# Altium schematic sheet PowerSupply.SchDoc: Power Supply
size A4; Date: 08.04.2017; Author: Jan Petrik; CompanyName: FreeDSP; DrawnBy: Jan Petrik; Organization: FreeDSP; DocumentNumber: 2; SheetNumber: 2; SheetTotal: 16; email: jan_petrik@centrum.cz; license: CC BY-NC 4.0; PageSetup: Record=PageOptions|CenterHorizontal=True|CenterVertical=True|PrintScale=0.97|XCorrection=1.00|YCorrection=1.00|PrintKind=2|BorderSize=5000000|LeftOffset=0|BottomOffset=0|Orientation=2|PaperLength=1000|PaperWidth=1000|Scale=100|PaperSource=7|PrintQuality=-3|MediaType=1|DitherType=10|PrintScaleMode=1|PaperKind=A4|PaperIndex=9; drawing number: blablabla; Version1: N/A; Version2: N/A; Version3: N/A; Change1description: N/A; Change2description: N/A; Change3description: N/A; Change1DrawnBy: N/A; Change2DrawnBy: N/A; Change3DrawnBy: N/A; Change1CheckedBy: N/A; Change2CheckedBy: N/A; Change3CheckedBy: N/A; PreviusVersion_Chng1: N/A; PreviusVersion_Chng2: N/A; PreviusVersion_Chng3: N/A; Variant1description: Standard assembly; Variant2description: N/A; Variant3description: N/A; Variant4description: N/A
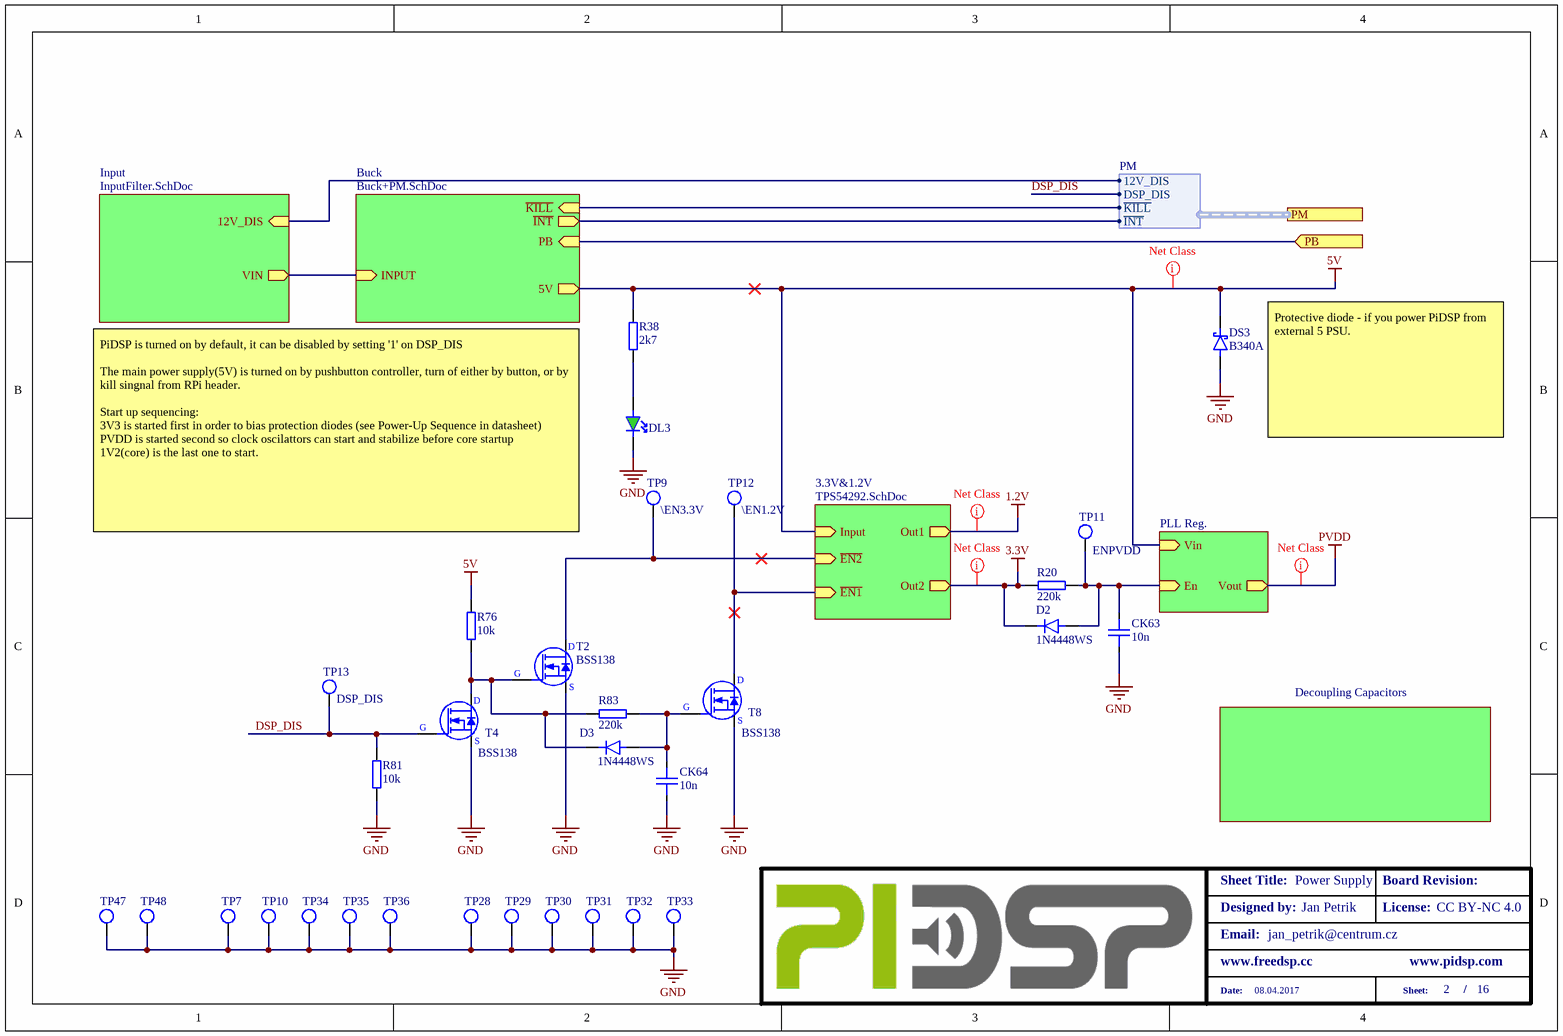
[diagram p0: PowerSupply.SchDoc]

## Parts
CK63  10n  [CAPC1608X09N(SMC0603)]
CK64  10n  [CAPC1608X09N(SMC0603)]
D2  1N4448WS  [SOD-323]
D3  1N4448WS  [SOD-323]
DL3  GREEN  [0603diode]  (value not drawn)
DS3  B340A  [DIOM5127X23N(SMA)]
R20  220k  [RESC1608X06N(SMR0603)]
R38  2k7  [RESC1608X06N(SMR0603)]
R76  10k  [RESC1608X06N(SMR0603)]
R81  10k  [RESC1608X06N(SMR0603)]
R83  220k  [RESC1608X06N(SMR0603)]
T2  BSS138  [SOT95P230X110-3N(SOT23)]
T4  BSS138  [SOT95P230X110-3N(SOT23)]
T8  BSS138  [SOT95P230X110-3N(SOT23)]
TP7  GND  [TP_0.8/0.4_ROUND]  (value not drawn)  (no BOM)
TP9  \EN3.3V  [TP_0.8/0.4_ROUND]  (no BOM)
TP10  GND  [TP_0.8/0.4_ROUND]  (value not drawn)  (no BOM)
TP11  ENPVDD  [TP_0.8/0.4_ROUND]  (no BOM)
TP12  \EN1.2V  [TP_0.8/0.4_ROUND]  (no BOM)
TP13  DSP_DIS  [TP_0.8/0.4_ROUND]  (no BOM)
TP28  GND  [TP_0.8/0.4_ROUND]  (value not drawn)  (no BOM)
TP29  GND  [TP_0.8/0.4_ROUND]  (value not drawn)  (no BOM)
TP30  GND  [TP_0.8/0.4_ROUND]  (value not drawn)  (no BOM)
TP31  GND  [TP_0.8/0.4_ROUND]  (value not drawn)  (no BOM)
TP32  GND  [TP_0.8/0.4_ROUND]  (value not drawn)  (no BOM)
TP33  GND  [TP_0.8/0.4_ROUND]  (value not drawn)  (no BOM)
TP34  GND  [TP_0.8/0.4_ROUND]  (value not drawn)  (no BOM)
TP35  GND  [TP_0.8/0.4_ROUND]  (value not drawn)  (no BOM)
TP36  GND  [TP_0.8/0.4_ROUND]  (value not drawn)  (no BOM)
TP47  GND  [TP_0.8/0.4_ROUND]  (value not drawn)  (no BOM)
TP48  GND  [TP_0.8/0.4_ROUND]  (value not drawn)  (no BOM)

## Sub-sheets
3.3V&1.2V = TPS54292.SchDoc: Out2 (out), Out1 (out), Input (in), ~{EN1} (in), ~{EN2} (in)
Buck = Buck+PM.SchDoc: PB (in), INPUT (in), 5V (out), ~{KILL} (in), ~{INT} (out)
Decoupling Capacitors = DSPPower.SchDoc: no entries
Input = InputFilter.SchDoc: VIN (out), 12V_DIS (in)
PLL Reg. = LP5907MFX-3.3NPB.SchDoc: Vin (in), Vout (out), En (in)

## Ports
PB (in), PM (harness PM)

## Harnesses
PM: ~{INT}, ~{KILL}, DSP_DIS, 12V_DIS

## Nets
1.2V: sheet 3.3V&1.2V/Out1
3.3V: D2.1(C) R20.2 ; sheet 3.3V&1.2V/Out2
5V: DS3.1(C) R38.1 R76.2 ; sheet PLL Reg./Vin, sheet 3.3V&1.2V/Input, sheet Buck/5V
GND: CK63.2 CK64.1 DL3.1(C) DS3.2(A) R81.1 T2.2(S) T4.2(S) T8.2(S) TP7.1 TP10.1 TP28.1 TP29.1 TP30.1 TP31.1 TP32.1 TP33.1 TP34.1 TP35.1 TP36.1 TP47.1 TP48.1
PVDD: sheet PLL Reg./Vout
DSP_DIS: R81.2 T4.1(G) TP13.1 ; port PM.DSP_DIS
PB: port PB, sheet Buck/PB
NetCK63_1: CK63.1 D2.2(A) R20.1 TP11.1 ; sheet PLL Reg./En
NetCK64_2: CK64.2 D3.2(A) R83.2 T8.1(G)
NetD3_1: D3.1(C) R76.1 R83.1 T2.1(G) T4.3(D)
NetDL3_2: DL3.2(A) R38.2
NetT2_3: T2.3(D) TP9.1 ; sheet 3.3V&1.2V/~{EN2}
NetT8_3: T8.3(D) TP12.1 ; sheet 3.3V&1.2V/~{EN1}
(unnamed): sheet Input/VIN, sheet Buck/INPUT
(unnamed): sheet Input/12V_DIS, port PM.12V_DIS
(unnamed): sheet Buck/~{KILL}, port PM.~{KILL}
(unnamed): sheet Buck/~{INT}, port PM.~{INT}

## Layout directives
net class POWER: 1.2V, 3.3V, 5V, PVDD

## Notes on the sheet
- (near DS3) Protective diode - if you power PiDSP from external 5 PSU.
- PiDSP is turned on by default, it can be disabled by setting '1' on DSP_DIS
  The main power supply(5V) is turned on by pushbutton controller, turn of either by button, or by kill singnal from RPi header.
  Start up sequencing:
  3V3 is started first in order to bias protection diodes (see Power-Up Sequence in datasheet)
  PVDD is started second so clock oscilattors can start and stabilize before core startup
  1V2(core) is the last one to start.
- Designed by:
- Sheet Title:
- Board Revision:
- License:
- Email:
- www.freedsp.cc
- www.pidsp.com
- Date:
- Sheet:
- /

## Library data of the parts
CK63 CK64 = 10n-50V-0603-X7R: MLCC; Signal Integrity: Cap; Voltage: 50V; Tolerance: 10%; Value: 10n; Package: SMC0603; Simulation: Cap; Author: JP/27.03.2014; Supplier 1: Mouser; Supplier Part Number 1: 81-GRM39X103K50D
D2 D3 = 1N4448WS: Small signal diode; Current: 0.150A; Voltage: 75V; SMD: 1; Type: Diode; Package: SOD-323; Supplier 1: Mouser; Supplier Part Number 1: 512-1N4448WS
DL3 = LED_GREEN_0603: Green LED, 0603; Author: JP/31.3.2014; SMD: 1; Supplier 1: Mouser; Supplier Part Number 1: 710-150060GS75000
DS3 = B340A: High Current Density SMT Schottky Rectifier, 3A/40V, SMA; SMD: 1; Supplier 1: Mouser; Supplier Part Number 1: 621-B340-F; Value: B340A
R20 R83 = 220k-100mW-0603-ThickFilm: Chip Resistor; Tolerance & Rating: 1%/0.1W; Signal Integrity: Res; Packare: SMR0603; Value: 220k; Simulation: Res; Author: JP/10.06.2014; SMD: 1; Supplier 1: Mouser; Supplier Part Number 1: 603-RC0603FR-07220KL; Type: Resistor
R38 = 2K7-100mW-0603-ThickFilm: Chip Resistor; Tolerance & Rating: 1%/0.1W; Signal Integrity: Res; Packare: SMR0603; Value: 2k7; Simulation: Res; Author: JP/26.03.2017; SMD: 1; Supplier 1: Mouser; Supplier Part Number 1: 603-RC0603FR-072K7L; Type: Resistor
R76 R81 = 10k-100mW-0603-ThickFilm: Chip Resistor; Tolerance & Rating: 1%/0.1W; Signal Integrity: Res; Packare: SMR0603; Value: 10k; Simulation: Res; Author: JP/10.06.2014; SMD: 1; Supplier 1: Mouser; Supplier Part Number 1: 603-RC0603FR-0710KL; Type: Resistor
T2 T4 T8 = ET+BSS138XX0: N-MOSFET, Logic Level, 50V/0,22A/3.5Ohm; Tolerance & Rating: 50 V/0,2 A/0,36 W; Author: JM 2.7.2014; SMD: 1; Value: BSS138; PN: BSS138; Supplier 1: Mouser; Supplier Part Number 1: 512-BSS138
TP7 TP9-TP13 TP28-TP36 TP47 TP48 = TEST_POINT_VIA: Testpoint - VIA; Value: 0.65/1.55; SMD: -; ClassName: TP